# Altium schematic sheet 电子脚铐手持式主控板_Frame.SchDoc
size A4
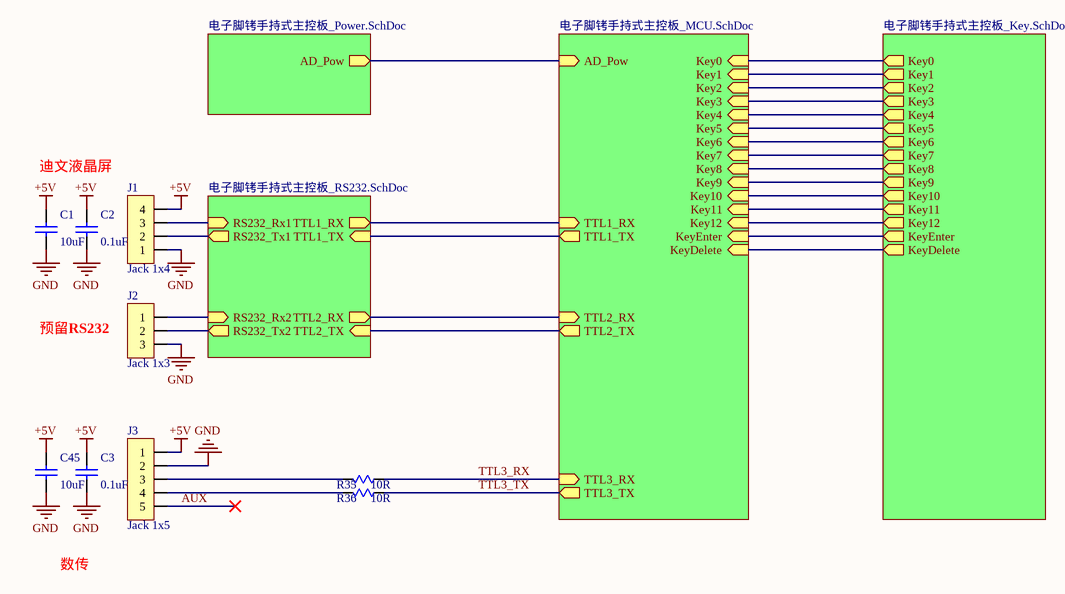
[diagram p0: 电子脚铐手持式主控板_Frame.SchDoc]

## Parts
C1  10uF  [C0603]
C2  0.1uF  [C0603]
C3  0.1uF  [C0603]
C45  10uF  [C0603]
J1  Jack 1x4  [XH-4AW]
J2  Jack 1x3  [XH-3AW]
J3  Jack 1x5  [PH-5A]
R35  10R  [R0603]
R36  10R  [R0603]

## Sub-sheets
Designator = 电子脚铐手持式主控板_Power.SchDoc: AD_Pow (out)
Designator = 电子脚铐手持式主控板_RS232.SchDoc: RS232_Tx1 (out), RS232_Rx1 (in), RS232_Rx2 (in), RS232_Tx2 (out), TTL1_RX (out), TTL2_RX (out), TTL1_TX (in), TTL2_TX (in)
Designator = 电子脚铐手持式主控板_Key.SchDoc: Key0 (out), Key1 (out), Key2 (out), Key3 (out), Key4 (out), Key5 (out), Key6 (out), Key7 (out), Key8 (out), Key9 (out), KeyEnter (out), KeyDelete (out), Key10 (out), Key11 (out), Key12 (out)
Designator = 电子脚铐手持式主控板_MCU.SchDoc: AD_Pow (in), TTL1_RX (in), TTL1_TX (out), TTL2_TX (out), TTL2_RX (in), Key0 (in), Key1 (in), Key2 (in), Key3 (in), Key4 (in), Key5 (in), Key6 (in), Key7 (in), Key8 (in), Key9 (in), KeyEnter (in), KeyDelete (in), TTL3_RX (in), TTL3_TX (out), Key10 (in), Key11 (in), Key12 (in)

## Nets
+5V: C1.1 C2.1 C3.1 C45.1 J1.4 J3.1
GND: C1.2 C2.2 C3.2 C45.2 J1.1 J2.3 J3.2
AUX: J3.5
TTL3_RX: R35.2 ; sheet Designator/TTL3_RX
TTL3_TX: R36.2 ; sheet Designator/TTL3_TX
NetJ1_2: J1.2 ; sheet Designator/RS232_Tx1
NetJ1_3: J1.3 ; sheet Designator/RS232_Rx1
NetJ2_1: J2.1 ; sheet Designator/RS232_Rx2
NetJ2_2: J2.2 ; sheet Designator/RS232_Tx2
NetJ3_3: J3.3 R35.1
NetJ3_4: J3.4 R36.1
(unnamed): sheet Designator/AD_Pow, sheet Designator/AD_Pow
(unnamed): sheet Designator/TTL1_RX, sheet Designator/TTL1_RX
(unnamed): sheet Designator/TTL2_RX, sheet Designator/TTL2_RX
(unnamed): sheet Designator/TTL1_TX, sheet Designator/TTL1_TX
(unnamed): sheet Designator/TTL2_TX, sheet Designator/TTL2_TX
(unnamed): sheet Designator/Key0, sheet Designator/Key0
(unnamed): sheet Designator/Key1, sheet Designator/Key1
(unnamed): sheet Designator/Key2, sheet Designator/Key2
(unnamed): sheet Designator/Key3, sheet Designator/Key3
(unnamed): sheet Designator/Key4, sheet Designator/Key4
(unnamed): sheet Designator/Key5, sheet Designator/Key5
(unnamed): sheet Designator/Key6, sheet Designator/Key6
(unnamed): sheet Designator/Key7, sheet Designator/Key7
(unnamed): sheet Designator/Key8, sheet Designator/Key8
(unnamed): sheet Designator/Key9, sheet Designator/Key9
(unnamed): sheet Designator/KeyEnter, sheet Designator/KeyEnter
(unnamed): sheet Designator/KeyDelete, sheet Designator/KeyDelete
(unnamed): sheet Designator/Key10, sheet Designator/Key10
(unnamed): sheet Designator/Key11, sheet Designator/Key11
(unnamed): sheet Designator/Key12, sheet Designator/Key12

## Notes on the sheet
- 迪文液晶屏
- 预留RS232
- 数传
- 文件名:
- 审核:
- 制图人:
- 孟浩
- 校对:
- 图号:
- 批准:
- 日期:

## Library data of the parts
C1-C3 C45 = CAP: Published: 8-Jun-2000; LatestRevisionDate: 17-Jul-2002; LatestRevisionNote: Re-released for DXP Platform.; PackageReference: RAD-0.3; Publisher: Altium Limited
J1 = Jack 1x4: 插座
J2 = Jack 1x3: 插座
J3 = Jack 1x5: 插座
R35 R36 = Res: Resistor; Published: 8-Jun-2000; LatestRevisionDate: 04-Mar-2005; LatestRevisionNote: PCB Footprint replaced.; PackageReference: J1-0603; Publisher: Altium Limited